# Altium project PCB_Project.PrjPcb
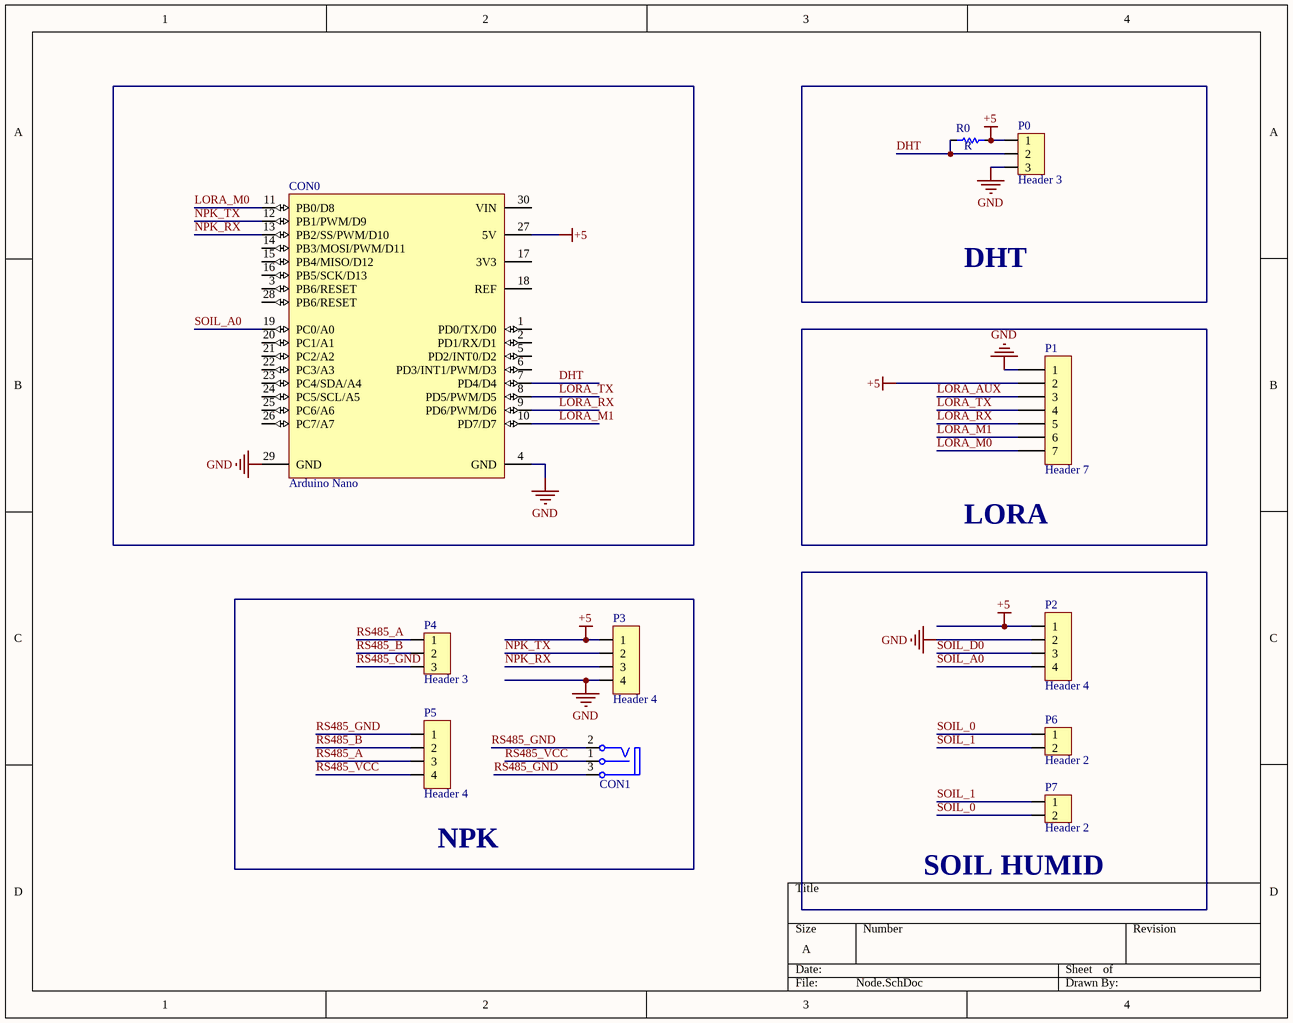
[diagram p0: Node.SchDoc]
2 sheets, 32 parts. Net scope: global (net labels, ports and power ports of the same name join across sheets).
Board files: Node.PcbDoc, Gateway.PcbDoc, Box.PcbDoc
Sheets:
  Node.SchDoc
  Gateway.SchDoc

## Sheet Node.SchDoc
size A; SheetNumber: 1; SheetTotal: 2

### Parts
CON0  Arduino Nano  [Arduino Nano 15x2]
CON1  CON DC PWR  [CONN/DC/PWR/5.0MM]  (value not drawn)
P0  Header 3  [XH2.54-3P]
P1  Header 7  [Header 7]
P2  Header 4  [Header 4]
P3  Header 4  [Header 4]
P4  Header 3  [SH152-5.08-3P]
P5  Header 4  [HDR DOMINO 4]
P6  Header 2  [Header 2]
P7  Header 2  [XH2.54-2P]
R0  R  [R 1206 (3216)]

### Nets
+5: CON0.27(5V) P0.1 P1.2 P2.1 P3.1 R0.2
GND: CON0.4(GND) CON0.29(GND) P0.3 P1.1 P2.2 P3.4
DHT: CON0.7(PD4/D4) P0.2 R0.1
LORA_AUX: P1.3
LORA_M0: CON0.11(PB0/D8) P1.7
LORA_M1: CON0.10(PD7/D7) P1.6
LORA_RX: CON0.9(PD6/PWM/D6) P1.5
LORA_TX: CON0.8(PD5/PWM/D5) P1.4
NPK_RX: CON0.13(PB2/SS/PWM/D10) P3.3
NPK_TX: CON0.12(PB1/PWM/D9) P3.2
RS485_A: P4.1 P5.3
RS485_B: P4.2 P5.2
RS485_GND: CON1.2(T) CON1.3(TN) P4.3 P5.1
RS485_VCC: CON1.1(S) P5.4
SOIL_0: P6.1 P7.2
SOIL_1: P6.2 P7.1
SOIL_A0: CON0.19(PC0/A0) P2.4
SOIL_D0: P2.3

Not connected (* = marked no-connect by the designer): CON0 1(PD0/TX/D0) 2(PD1/RX/D1) 3(PB6/RESET) 5(PD2/INT0/D2) 6(PD3/INT1/PWM/D3) 14(PB3/MOSI/PWM/D11) 15(PB4/MISO/D12) 16(PB5/SCK/D13) 17(3V3) 18(REF) 20(PC1/A1) 21(PC2/A2) 22(PC3/A3) 23(PC4/SDA/A4) 24(PC5/SCL/A5) 25(PC6/A6) 26(PC7/A7) 28(PB6/RESET) 30(VIN)

### Notes on the sheet
- DHT
- (near P1) LORA
- (near P5) NPK
- (near P7) SOIL HUMID

### Library data of the parts
CON0 = Arduino Nano: Arduino Nano 15X2
CON1 = CON DC PWR: DC input connector
P0 P4 = Header 3: Header, 3-Pin
P1 = Header 7: Header, 7-Pin; LatestRevisionDate: 17-Jul-2002; LatestRevisionNote: Re-released for DXP Platform.; Publisher: Altium Limited
P2 P3 P5 = Header 4: Header, 4-Pin
P6 P7 = Header 2: Header, 2-Pin; LatestRevisionDate: 17-Jul-2002; LatestRevisionNote: Re-released for DXP Platform.; Publisher: Altium Limited
R0 = Resistor: Published: 8-Jun-2000; LatestRevisionDate: 17-Jul-2002; LatestRevisionNote: Re-released for DXP Platform.; PackageReference: AXIAL-0.3; Publisher: Altium Limited

## Sheet Gateway.SchDoc
size B; SheetNumber: 2; SheetTotal: 2
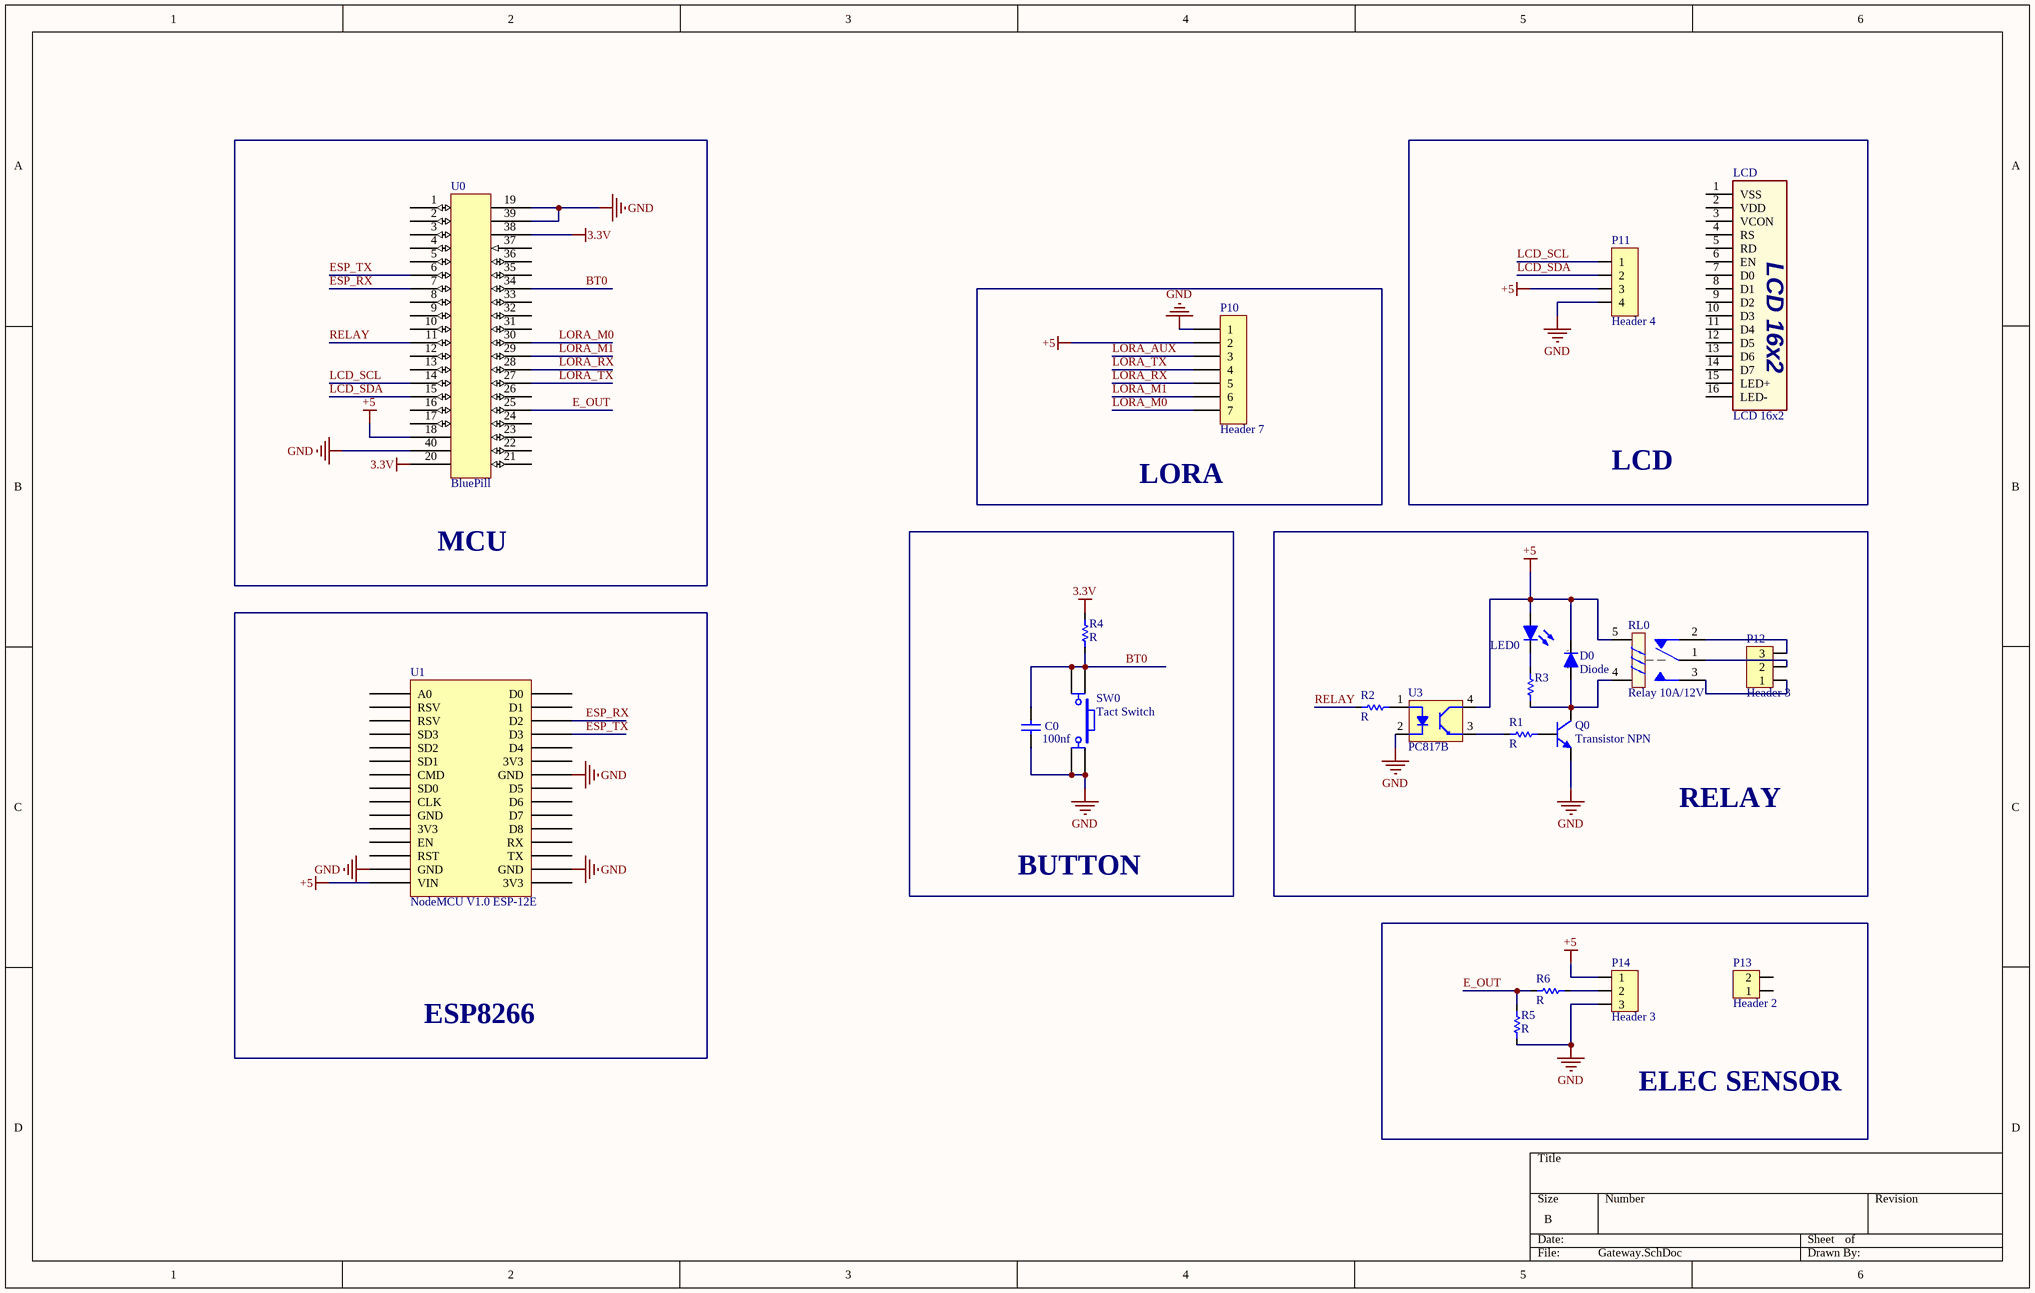
[diagram p1: Gateway.SchDoc]

### Parts
C0  100nf  [C 0805 (2012)]
D0  Diode  [SOD-80]
LCD  LCD 16x2  [LCD 16x2]
LED0  Led  [LED 3MM]  (value not drawn)
P10  Header 7  [Header 7]
P11  Header 4  [XH2.54-4P-RA]
P12  Header 3  [SH152-5.08-3P]
P13  Header 2  [HDR Domino 2 - 5MM]
P14  Header 3  [Header 3]
Q0  Transistor NPN  [SOT-23]
R1  R  [R 0805 (2012)]
R2  R  [R 0805 (2012)]
R3  R0  [R 0805 (2012)]  (value not drawn)
R4  R  [R 0805 (2012)]
R5  R  [R 0805 (2012)]
R6  R  [R 0805 (2012)]
RL0  Relay 10A/12V  [RL_SPDT_10A]
SW0  Tact Switch  [SW/4/DIP/SMALL]
U0  BluePill  [YAAJ_BluePill_1]
U1  NodeMCU V1.0 ESP-12E  [NodeMCU V1.0 ESP-12E]
U3  PC817B  [SOIC-4-GULLWING]

### Nets
3.3V: R4.1 U0.20 U0.38
+5: D0.1(Cathode) LED0.2(A) P10.2 P11.3 P14.1 RL0.5 U0.18 U1.VIN U3.4(C)
GND: C0.2 P10.1 P11.4 P14.3 Q0.2(E) R5.2 SW0.2 SW0.3 U0.19 U0.39 U0.40 U1.GND U3.2(K)
BT0: C0.1 R4.2 SW0.1 SW0.4 U0.34
E_OUT: R5.1 R6.2 U0.25
ESP_RX: U0.7 U1.D2
ESP_TX: U0.6 U1.D3
LCD_SCL: P11.1 U0.14
LCD_SDA: P11.2 U0.15
LORA_AUX: P10.3
LORA_M0: P10.7 U0.30
LORA_M1: P10.6 U0.29
LORA_RX: P10.5 U0.28
LORA_TX: P10.4 U0.27
RELAY: R2.2 U0.11
NetD0_2: D0.2(Anode) Q0.3(C) R3.1 RL0.4
NetLED0_1: LED0.1(K) R3.2
NetP12_1: P12.1 RL0.3
NetP12_2: P12.2 RL0.1
NetP12_3: P12.3 RL0.2
NetP14_2: P14.2 R6.1
NetQ0_1: Q0.1(B) R1.1
NetR1_2: R1.2 U3.3(E)
NetR2_1: R2.1 U3.1(A)

Not connected (* = marked no-connect by the designer): LCD 1(VSS) 2(VDD) 3(VCON) 4(RS) 5(RD) 6(EN) 7(D0) 8(D1) 9(D2) 10(D3) 11(D4) 12(D5) 13(D6) 14(D7) 15(LED+) 16(LED-); P13 1 2; U0 1 2 3 4 5 8 9 10 12 13 16 17 21 22 23 24 26 31 32 33 35 36 37; U1 3V3 A0 CLK CMD D0 D1 D4 D5 D6 D7 D8 EN RST RSV RX SD0 SD1 SD2 SD3 TX

### Notes on the sheet
- (near P10) LORA
- LCD
- MCU
- RELAY
- BUTTON
- ESP8266
- ELEC SENSOR
- (in symbol Diode) k; a

### Library data of the parts
C0 = Capacitor NP: Capacitor non-pol
D0 = Diode: Default Diode; Published: 8-Jun-2000; LatestRevisionDate: 17-Jul-2002; LatestRevisionNote: Re-released for DXP Platform.; PackageVersion: Sep-1996; PackageReference: SMC; Publisher: Altium Limited; Code_JEDEC: DO-214-AB
LCD = LCD 16x2: Character LCD 16x2
LED0 = Led: Typical LED
P10 = Header 7: Header, 7-Pin; LatestRevisionDate: 17-Jul-2002; LatestRevisionNote: Re-released for DXP Platform.; Publisher: Altium Limited
P11 = Header 4: Header, 4-Pin
P12 P14 = Header 3: Header, 3-Pin
P13 = Header 2: Header, 2-Pin; LatestRevisionDate: 17-Jul-2002; LatestRevisionNote: Re-released for DXP Platform.; Publisher: Altium Limited
Q0 = Transistor NPN: NPN Bipolar Transistor
R1-R6 = Resistor: Published: 8-Jun-2000; LatestRevisionDate: 17-Jul-2002; LatestRevisionNote: Re-released for DXP Platform.; PackageReference: AXIAL-0.3; Publisher: Altium Limited
RL0 = Relay 1: Relay SPDT,10A - 12VDC 5 Pin; Value: Relay SPDT, 10A, 12V
SW0 = SW SPST-4: Tact switch 4 pin
U1 = NodeMCU V1.0 ESP-12E: NodeMCU V1.0 ESP8266 (ESP-12E)
U3 = Opto PC817B

## Nets that join several sheets
+5: Node (6 pins), Gateway (9 pins)
GND: Node (6 pins), Gateway (13 pins)
LORA_AUX: Node (P1.3), Gateway (P10.3)
LORA_M0: Node (CON0.11 P1.7), Gateway (P10.7 U0.30)
LORA_M1: Node (CON0.10 P1.6), Gateway (P10.6 U0.29)
LORA_RX: Node (CON0.9 P1.5), Gateway (P10.5 U0.28)
LORA_TX: Node (CON0.8 P1.4), Gateway (P10.4 U0.27)